# EAGLE design OSO-SCAN-A1-00 Sensor Candle Concept (EAGLE 9.6.2)
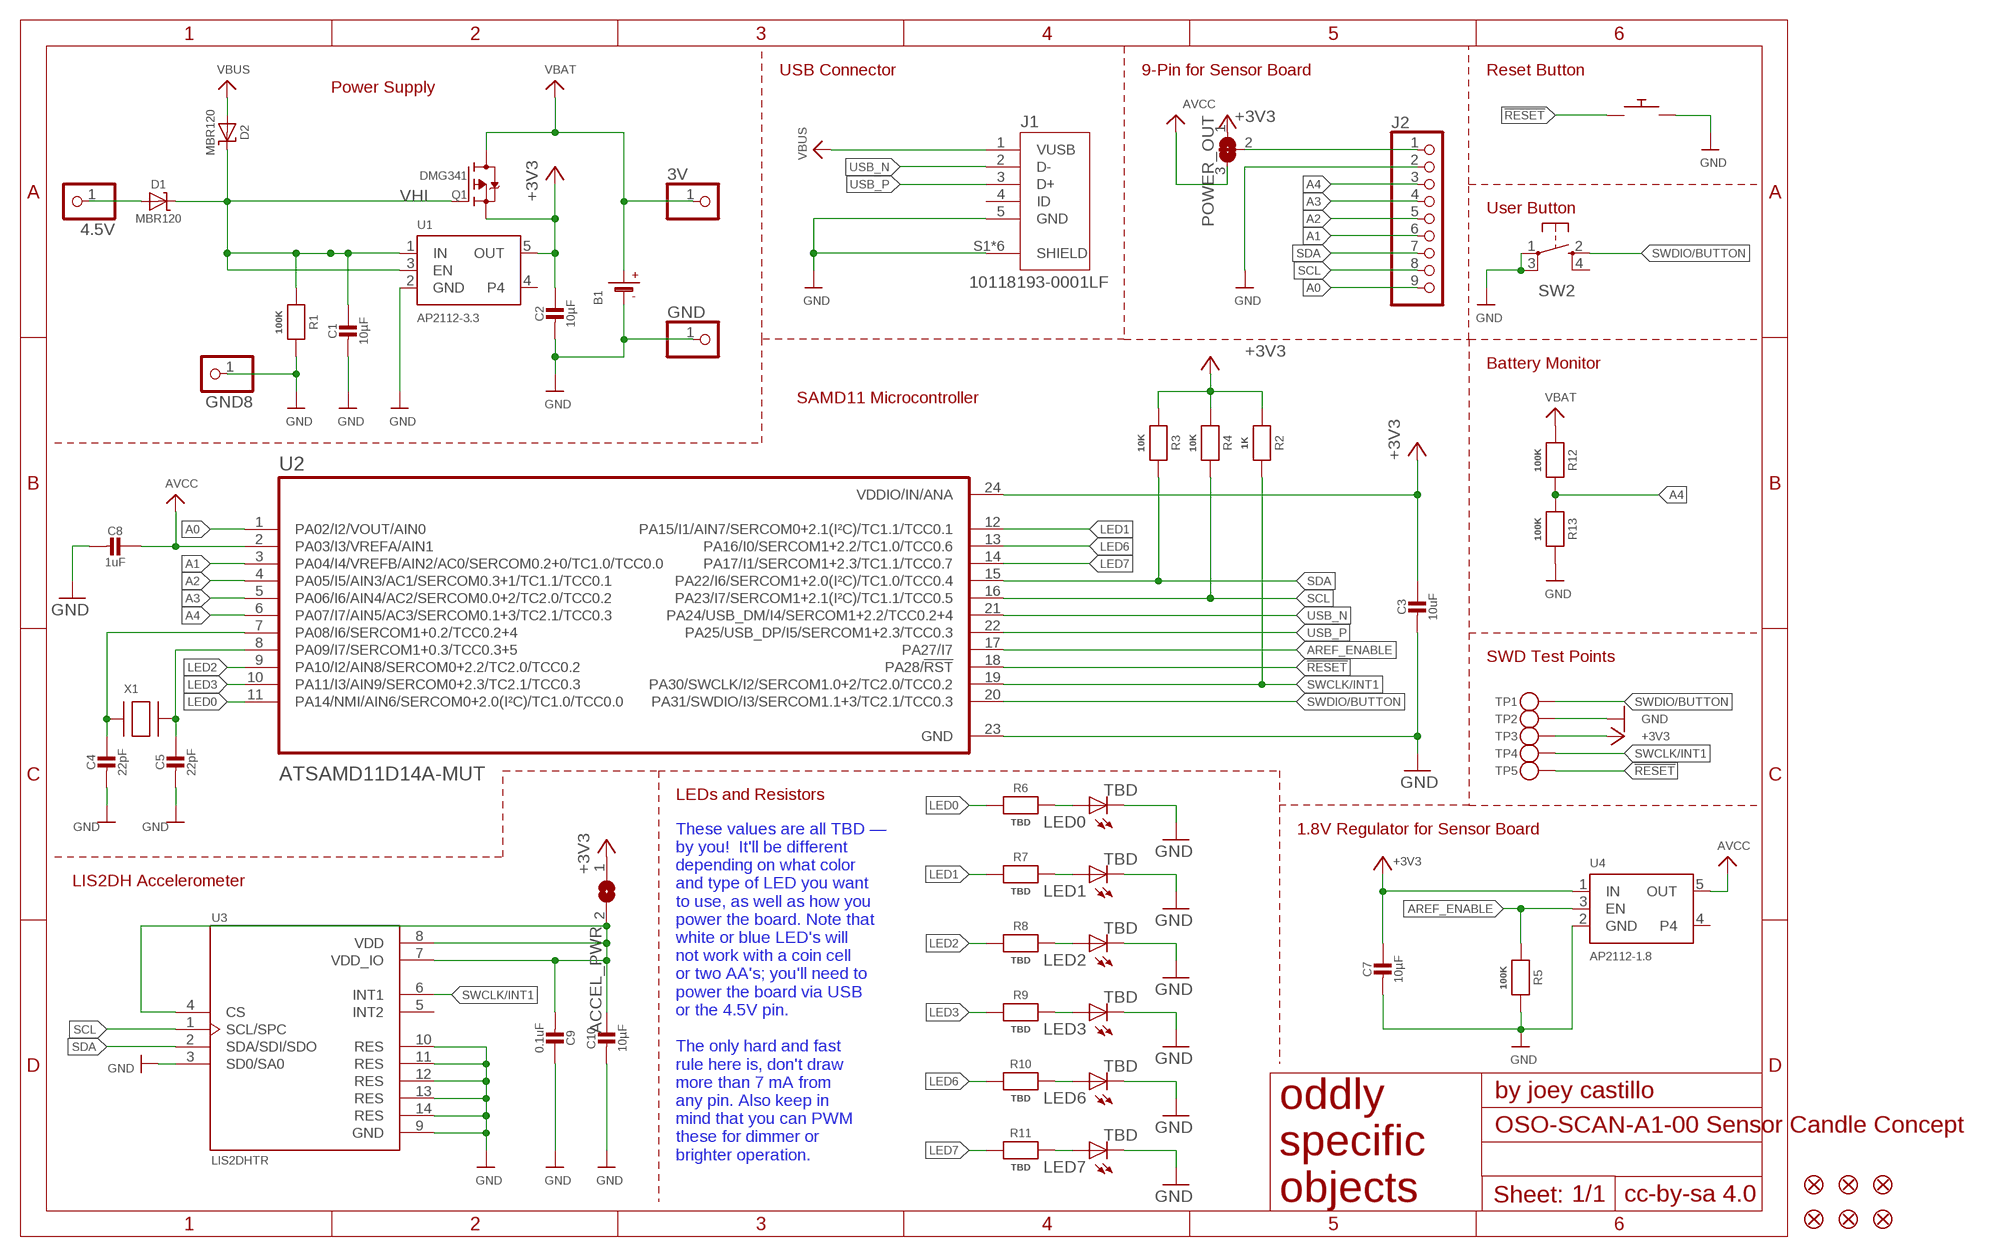
[diagram p0: schematic, sheet 1]

## Parts
3V  PINHD-1X1  [1X01]
4.5V  PINHD-1X1  [1X01]
ACCEL_PWR  SOLDERJUMPERREFLOW_NOPASTE  [SOLDERJUMPER_REFLOW_NOPASTE]
B1  BATTERY  [CR2032_SMT_BAT-HLD-BC-2003]
C1  10µF  CAP_CERAMIC0805-NOOUTLINE  [0805-NO]
C2  10µF  CAP_CERAMIC0805-NOOUTLINE  [0805-NO]
C3  10uF  CAP_CERAMIC0805-NOOUTLINE  [0805-NO]
C4  22pF  CAP_CERAMIC0805-NOOUTLINE  [0805-NO]
C5  22pF  CAP_CERAMIC0805-NOOUTLINE  [0805-NO]
C7  10µF  CAP_CERAMIC0805-NOOUTLINE  [0805-NO]
C8  1uF  CAP_CERAMIC0805-NOOUTLINE  [0805-NO]
C9  0.1uF  CAP_CERAMIC0805-NOOUTLINE  [0805-NO]
C10  10µF  CAP_CERAMIC0805-NOOUTLINE  [0805-NO]
D1  MBR120  DIODE-SCHOTTKYSOD-123  [SOD-123]
D2  MBR120  DIODE-SCHOTTKYSOD-123  [SOD-123]
FID1  FIDUCIAL_1MM  [FIDUCIAL_1MM]
FID2  FIDUCIAL_1MM  [FIDUCIAL_1MM]
FID3  FIDUCIAL_1MM  [FIDUCIAL_1MM]
FID4  FIDUCIAL_1MM  [FIDUCIAL_1MM]
FID5  FIDUCIAL_1MM  [FIDUCIAL_1MM]
FID6  FIDUCIAL_1MM  [FIDUCIAL_1MM]
GND  PINHD-1X1  [1X01]
GND8  PINHD-1X1  [1X01]
J1  10118193-0001LF  [FCI_10118193-0001LF]
J2  HEADER-1X9_JSTSH  [JST_SH9]
LED0  TBD  LEDCHIP-LED0805  [CHIP-LED0805]
LED1  TBD  LEDCHIP-LED0805  [CHIP-LED0805]
LED2  TBD  LEDCHIP-LED0805  [CHIP-LED0805]
LED3  TBD  LEDCHIP-LED0805  [CHIP-LED0805]
LED6  TBD  LEDCHIP-LED0805  [CHIP-LED0805]
LED7  TBD  LEDCHIP-LED0805  [CHIP-LED0805]
POWER_OUT  SOLDERJUMPER_2WAY  [SOLDERJUMPER_2WAY_OPEN_NOPASTE]
Q1  DMG341  MOSFET-P  [SOT23-R]
R1  100K  RESISTOR0805_NOOUTLINE  [0805-NO]
R2  1K  RESISTOR0805_NOOUTLINE  [0805-NO]
R3  10K  RESISTOR0805_NOOUTLINE  [0805-NO]
R4  10K  RESISTOR0805_NOOUTLINE  [0805-NO]
R5  100K  RESISTOR0805_NOOUTLINE  [0805-NO]
R6  TBD  RESISTOR0805_NOOUTLINE  [0805-NO]
R7  TBD  RESISTOR0805_NOOUTLINE  [0805-NO]
R8  TBD  RESISTOR0805_NOOUTLINE  [0805-NO]
R9  TBD  RESISTOR0805_NOOUTLINE  [0805-NO]
R10  TBD  RESISTOR0805_NOOUTLINE  [0805-NO]
R11  TBD  RESISTOR0805_NOOUTLINE  [0805-NO]
R12  100K  RESISTOR0805_NOOUTLINE  [0805-NO]
R13  100K  RESISTOR0805_NOOUTLINE  [0805-NO]
RESET  SWITCH_PUSHBUTTONC&K_KSS  [BTN_CK_KSS]
SW2  SPST_TACT-KMR2  [KMR2]
TP1  TESTPOINTROUND2MMNO  [TESTPOINT_ROUND_2MM_NO]
TP2  TESTPOINTROUND2MMNO  [TESTPOINT_ROUND_2MM_NO]
TP3  TESTPOINTROUND2MMNO  [TESTPOINT_ROUND_2MM_NO]
TP4  TESTPOINTROUND2MMNO  [TESTPOINT_ROUND_2MM_NO]
TP5  TESTPOINTROUND2MMNO  [TESTPOINT_ROUND_2MM_NO]
U1  AP2112-3.3  VREG_SOT23-5  [SOT23-5]
U2  ATSAMD11D14A-MUT  [QFN50P400X400X90-25N]
U3  LIS2DHTR  [PQFN35P200X200X100-14N]
U4  AP2112-1.8  VREG_SOT23-5  [SOT23-5]
X1  XTAL-3.2X1.5  [XTAL3215]

## Nets
4.5V: 4.5V.1 D1.A
!RESET: RESET.P$1 TP5.P$1 U2.18(PA28/!RST)
+3V3 [power]: ACCEL_PWR.1 C2.1 C3.1 C7.1 POWER_OUT.1 Q1.2(S) R2.1 R3.1 R4.1 TP3.P$1 U1.5(OUT) U2.24(VDDIO/IN/ANA) U4.1(IN)
A0: J2.9 U2.1(PA02/I2/VOUT/AIN0)
A1: J2.6 U2.3(PA04/I4/VREFB/AIN2/AC0/SERCOM0.2+0/TC1.0/TCC0.0)
A2: J2.5 U2.4(PA05/I5/AIN3/AC1/SERCOM0.3+1/TC1.1/TCC0.1)
A3: J2.4 U2.5(PA06/I6/AIN4/AC2/SERCOM0.0+2/TC2.0/TCC0.2)
A4: J2.3 R12.2 R13.1 U2.6(PA07/I7/AIN5/AC3/SERCOM0.1+3/TC2.1/TCC0.3)
ACCEL_POWER: ACCEL_PWR.2 C9.2 C10.1 U3.4(CS) U3.7(VDD_IO) U3.8(VDD)
AREF_ENABLE: R5.1 U2.17(PA27/I7) U4.3(EN)
AVCC [power]: C8.1 POWER_OUT.3 U2.2(PA03/I3/VREFA/AIN1) U4.5(OUT)
GND [gnd]: B1.- C1.2 C2.2 C3.2 C4.2 C5.2 C7.2 C8.2 C9.1 C10.2 GND8.1 GND.1 J1.5(GND) J1.S1(SHIELD) J1.S2(SHIELD) J1.S3(SHIELD) J1.S4(SHIELD) J1.S5(SHIELD) J1.S6(SHIELD) J2.2 LED0.C LED1.C LED2.C LED3.C LED6.C LED7.C R1.2 R5.2 R13.2 RESET.P$2 SW2.1(P) SW2.3(P1) TP2.P$1 U1.2(GND) U2.23(GND) U3.3(SD0/SA0) U3.9(GND) U3.10(RES) U3.11(RES) U3.12(RES) U3.13(RES) U3.14(RES) U4.2(GND)
LED0: R6.1 U2.11(PA14/NMI/AIN6/SERCOM0+2.0(I²C)/TC1.0/TCC0.0)
LED1: R7.1 U2.12(PA15/I1/AIN7/SERCOM0+2.1(I²C)/TC1.1/TCC0.1)
LED2: R8.1 U2.9(PA10/I2/AIN8/SERCOM0+2.2/TC2.0/TCC0.2)
LED3: R9.1 U2.10(PA11/I3/AIN9/SERCOM0+2.3/TC2.1/TCC0.3)
LED6: R10.1 U2.13(PA16/I0/SERCOM1+2.2/TC1.0/TCC0.6)
LED7: R11.1 U2.14(PA17/I1/SERCOM1+2.3/TC1.1/TCC0.7)
N$2: LED1.A R7.2
N$4: LED2.A R8.2
N$5: LED0.A R6.2
N$6: LED3.A R9.2
N$7: LED6.A R10.2
N$8: LED7.A R11.2
POWER_OUT [power]: J2.1 POWER_OUT.2
SCL: J2.8 R4.2 U2.16(PA23/I7/SERCOM1+2.1(I²C)/TC1.1/TCC0.5) U3.1(SCL/SPC)
SDA: J2.7 R3.2 U2.15(PA22/I6/SERCOM1+2.0(I²C)/TC1.0/TCC0.4) U3.2(SDA/SDI/SDO)
SWCLK/INT1: R2.2 TP4.P$1 U2.19(PA30/SWCLK/I2/SERCOM1.0+2/TC2.0/TCC0.2) U3.6(INT1)
SWDIO/BUTTON: SW2.2(S) TP1.P$1 U2.20(PA31/SWDIO/I3/SERCOM1.1+3/TC2.1/TCC0.3)
USB_N: J1.2(D-) U2.21(PA24/USB_DM/I4/SERCOM1+2.2/TCC0.2+4)
USB_P: J1.3(D+) U2.22(PA25/USB_DP/I5/SERCOM1+2.3/TCC0.3)
VBAT [power]: 3V.1 B1.+$1(+) B1.+$2(+) Q1.3(D) R12.1
VBUS [power]: D2.A J1.1(VUSB)
VHI [power]: C1.1 D1.C D2.C Q1.1(G) R1.1 U1.1(IN) U1.3(EN)
XIN32: C4.1 U2.7(PA08/I6/SERCOM1+0.2/TCC0.2+4) X1.P$1
XOUT32: C5.1 U2.8(PA09/I7/SERCOM1+0.3/TCC0.3+5) X1.P$2
Unconnected: J1.4(ID) SW2.4(S1) U1.4 U3.5(INT2) U4.4

## Notes on the sheet
- USB Connector | 9-Pin for Sensor Board | Reset Button
- Power Supply
- User Button
- Battery Monitor
- SAMD11 Microcontroller
- SWD Test Points
- LEDs and Resistors
- These values are all TBD — 
  by you!  It'll be different 
  depending on what color 
  and type of LED you want 
  to use, as well as how you 
  power the board. Note that
  white or blue LED's will
  not work with a coin cell
  or two AA's; you'll need to
  power the board via USB 
  or the 4.5V pin.
  
  The only hard and fast 
  rule here is, don't draw 
  more than 7 mA from 
  any pin. Also keep in 
  mind that you can PWM 
  these for dimmer or 
  brighter operation.
- 1.8V Regulator for Sensor Board
- LIS2DH Accelerometer

## Library data of the parts
3V 4.5V GND GND8 = pinhead-round:PINHD-1X1: PIN HEADER
ACCEL_PWR = microbuilder:SOLDERJUMPER: SMD Solder JUMPER Solder the two pads together to create a connection, or remove the solder to break it. REFLOW - Use this footprint for solder paste and reflow ovens. WAVE - Use this footprint for hand-soldering (larger pads). CLOSED - Has a trace between the two pads to ensure it is closed by default. The trace needs to be cut to disable the jumper, and can be closed again by creating a solder bridge between the two pads.
B1 = OSO-VOCA-A1-00:BATTERY: CR1220 SMT - Digikey: 3001K-ND CD2032 BAT-HLD-001 - Digikey: BAT-HLD-001-ND
C1-C5 C7-C10 = microbuilder:CAP_CERAMIC: Ceramic Capacitors For new designs, use the packages preceded by an '_' character since they are more reliable: The following footprints should be used on most boards: _0402 - Standard footprint for regular board layouts _0603 - Standard footprint for regular board layouts _0805 - Standard footprint for regular board layouts _1206 - Standard footprint for regular board layouts For extremely tight-pitch boards where space is at a premium, the following 'micro-pitch' footprints can be used (smaller pads, no silkscreen outline, etc.): _0402MP - Micro-pitch footprint for very dense/compact boards _0603MP - Micro-pitch footprint for very dense/compact boards _0805MP - Micro-pitch footprint for very dense/compact boards _1206MP - Micro-pitch footprint for very dense/compact boards
D1 D2 = microbuilder:DIODE-SCHOTTKY
FID1-FID6 = microbuilder:FIDUCIAL: Fiducial Alignment Points Various fiducial points for machine vision alignment.; BOM: EXCLUDE
J1 = 10118193-0001LF:10118193-0001LF: Micro USB B Type Receptacle; DESCRIPTION: Single Port 5 Contact Shielded SMT MICRO USB B-Type Receptacle; DIGI-KEY_PART_NUMBER: 609-4616-1-ND; DIGI-KEY_PURCHASE_URL: https://www.digikey.com/product-detail/en/amphenol-icc-fci/10118193-0001LF/609-4616-1-ND/2785380?utm_source=snapeda&utm_medium=aggregator&utm_campaign=symbol; MF: Amphenol ICC; MP: 10118193-0001LF; PACKAGE: None
J2 = microbuilder:HEADER-1X9: PIN HEADER
LED0 LED1-LED3 LED6 LED7 = adafruit:LED: LED OSRAM: - CHIPLED LG R971, LG N971, LY N971, LG Q971, LY Q971, LO R971, LY R971 LH N974, LH R974 LS Q976, LO Q976, LY Q976 LO Q996 - Hyper CHIPLED LW Q18S LB Q993, LB Q99A, LB R99A - SideLED LS A670, LO A670, LY A670, LG A670, LP A670 LB A673, LV A673, LT A673, LW A673 LH A674 LY A675 LS A676, LA A676, LO A676, LY A676, LW A676 LS A679, LY A679, LG A679 - Hyper Micro SIDELED® LS Y876, LA Y876, LO Y876, LY Y876 LT Y87S - SmartLED LW L88C, LW L88S LB L89C, LB L89S, LG L890 LS L89K, LO L89K, LY L89K LS L896, LA L896, LO L896, LY L896 - TOPLED LS T670, LO T670, LY T670, LG T670, LP T670 LSG T670, LSP T670, LSY T670, LOP T670, LYG T670 LG T671, LOG T671, LSG T671 LB T673, LV T673, LT T673, LW T673 LH T674 LS T676, LA T676, LO T676, LY T676, LB T676, LH T676, LSB T676, LW T676 LB T67C, LV T67C, LT T67C, LS T67K, LO T67K, LY T67K, LW E67C LS E67B, LA E67B, LO E67B, LY E67B, LB E67C, LV E67C, LT E67C LW T67C LS T679, LY T679, LG T679 LS T770, LO T770, LY T770, LG T770, LP T770 LB T773, LV T773, LT T773, LW T773 LH T774 LS E675, LA E675, LY E675, LS T675 LS T776, LA T776, LO T776, LY T776, LB T776 LHGB T686 LT T68C, LB T68C - Hyper Mini TOPLED® LB M676 - Mini TOPLED Santana® LG M470 LS M47K, LO M47K, LY M47K Source: http://www.osram.convergy.de/
POWER_OUT = pygamer-microbuilder:SOLDERJUMPER_2WAY: 2-Way Solder Jumper
Q1 = microbuilder:MOSFET-P: P-Channel Mosfet LEGEND VDS: Voltage Drain-Source ID: Drain Current RDS(ON): Drain-Source On-State Resistance VGS(TH): Gate-Source Threshold Voltage CISS: Drain-Source Input Capacitance SOT-23 Name VDS ID RDS(ON) VGS(TH) CISS Order Number IRLML5103 30V 760mA 600 mOhm -- 75pF @ 25V Digikey: IRLML5103PBFCT-ND IRLML6401 12V 4.3A 50 mOhm 950mV @ 250µA 830pF @ 10V Digikey: IRLML6401PBFTR-ND NTR0202PL 20V 400mA 800 mOhm 2.3V @ 250uA 70pF @ 5V Digikey: NTR0202PLT1GOSTR-ND NTR4101PT1G 20V 1.8A 85 mOhm 1.2V @ 250uA 675pF @ 10V Digikey: NTR4101PT1GOSCT-ND DMP2004K 20V 600mA 900 mOhm 1V @ 250uA 175pF @ 16V Digikey: DMP2004KDICT-ND PMV65XP 20V 3.9A 76 mOhm 950mV @ 1mA 725pF @ 20V Digikey: 568-2358-2-ND TO-252 Name VDS ID RDS(ON) VGS(TH) CISS Order Number AOD417 30V 25A 34 mOhm 3V @ 250µA 920pF @ 15V Digikey: 785-1106-2-ND PowerPak Name VDS ID RDS(ON) VGS(TH) CISS Order Number AON7401 30V 12A 14 mOhm 3V @ 250µA 2600pF @ 15V Digikey: 785-1302-1-ND
R1-R13 = microbuilder:RESISTOR: Resistors For new designs, use the packages preceded by an '_' character since they are more reliable: The following footprints should be used on most boards: _0402 - Standard footprint for regular board layouts _0603 - Standard footprint for regular board layouts _0805 - Standard footprint for regular board layouts _1206 - Standard footprint for regular board layouts For extremely tight-pitch boards where space is at a premium, the following 'micro-pitch' footprints can be used (smaller pads, no silkscreen outline, etc.): _0402MP - Micro-pitch footprint for very dense/compact boards _0603MP - Micro-pitch footprint for very dense/compact boards _0805MP - Micro-pitch footprint for very dense/compact boards _1206MP - Micro-pitch footprint for very dense/compact boards
RESET = adafruit:SWITCH_PUSHBUTTON: Buttons SOFTTOUCHSMD_SJ - Soft touch temporary push button (Super Junk Akihabara) Compatible with SKPMANE010 [Mouser: 688-SKPMAN] C&K_KSS = Digikey: KSS221GLFS
SW2 = adafruit:SPST_TACT: SMT 6mm switch, EVQQ2 series http://www.ladyada.net/library/eagle
TP1-TP5 = microbuilder:TESTPOINT: Test Point Various test points for characterisation and PCB testing TESTPOINT_SMT - Compact Surface Mount Test Point [Digikey: 5016KTR-ND]
U1 U4 = microbuilder:VREG_SOT23-5: SOT23-5 Fixed Voltage Regulators Part Current Out V Out V In V Dropout θJA (°C/W) TJ (°C) Digikey Part No. ADP121 150mA 3.3V 3.4-5.5V 0.09V @ 150mA -- -- ADP121-AUJZ33R7CT-ND ADP121 150mA 3.0V 3.1-5.5V 0.09V @ 150mA -- -- ADP121-AUJZ30R7CT-ND ADP122 300mA 3.3V 3.4-5.5V 0.085V @ 300mA -- -- ADP122AUJZ-3.3-R7CT-ND ADP1712 300mA 3.3V 3.5-5.5V 0.17V @ 300mA -- -- ADP1712AUJZ-3.3-R7TR-ND AP7311 (Low Cost) 150mA 3.3V 3.5-6V 0.15V @ 150mA -- -- AP7311-33WG-7DICT-ND LD39015M18R 150mA 1.8V 1.9V-5.5V 0.08V @ 100mA -- -- 497-6977-1-ND LP2985A-33DBVR 150mA 3.3V 3.3-16V 0.28V @ 150mA 206 150 296-18479-1-ND MCP1824T-3302E/OT 300mA 3.3V 3.5V-6V 0.2V @ 300mA -- -- MCP1824T-3302E/OTCT-ND MIC5205-2.5YM5 TR 150mA 2.5V 2.7-16V 0.165V @ 150mA -- -- 576-1257-2-ND MIC5205-3.0YM5 TR 150mA 3.0V 3.2V-16V 0.165V @ 150mA -- -- 576-1258-2-ND MIC5205-3.3YM5 TR 150mA 3.3V 3.5V-16V 0.165V @ 150mA -- -- 576-1259-2-ND TPS780330220 150mA 3.3V+2.2V 3.6-5.5V 250mV Max -- -- 296-23332-1-ND TDA3663/N1,135 100mA 3.3V 3.5-45V 0.18V @ 50mA -- -- 568-5343-1-ND Max operating temp can be calculated using θJA, TJ (max junction temperature), and power in watts. Set the "Maximum Ambient Temperature" until it reaches TJ ("Max Junction Temperature"), which is the absolute limit for safe use of the regulator: Heat Sink Temperature Calculator <http://www.daycounter.com/Calculators/Heat-Sink-Temperature-Calculator.phtml> For example, With 12V source into a 3.3V LP2985 and a 30mA load, we are dissipating (12V-3.3V) * 0.03A = 0.261W. With a θJA of 206 °C/W, a TJ of 150°C, and 261mW we can safely use the chip without a heat sink up to 75°C (=147.1°C Junction Temperature).
U2 = My Stuff:ATSAMD11D14A-MUT: None; AVAILABILITY: Unavailable; DESCRIPTION: Cortex-M0+, 16KB FLASH, 4KB SRAM, USB - 24 QFN, INDUSTRIAL, GREEN, 1.6-3.6V, 48MHz/ QFN _ZA_; MF: Microchip; MP: ATSAMD11D14A-MUT; PACKAGE: QFN-24 Microchip; PRICE: None
U3 = LIS2DHTR:LIS2DHTR: MEMS digital output motion sensor: ultra low-power high performance 3-axes femto accelerometer; DESCRIPTION: Accelerometer X, Y, Z Axis ±2g, 4g, 8g, 16g 0.5Hz ~ 672Hz 14-LGA _2x2_; DIGI-KEY_PART_NUMBER: 497-13795-1-ND; DIGI-KEY_PURCHASE_URL: https://www.digikey.com/product-detail/en/stmicroelectronics/LIS2DHTR/497-13795-1-ND/4209308?utm_source=snapeda&utm_medium=aggregator&utm_campaign=symbol; MF: STMicroelectronics; MP: LIS2DHTR; PACKAGE: LGA-14 STMicroelectronics
X1 = adafruit:XTAL: Low cost SMT crystals, no capacitors included http://www.ladyada.net/library/eagle

## Net classes
0 default: width 0.152 mm, drill 0.254 mm
1 power: width 0.254 mm, drill 0.254 mm

## Board
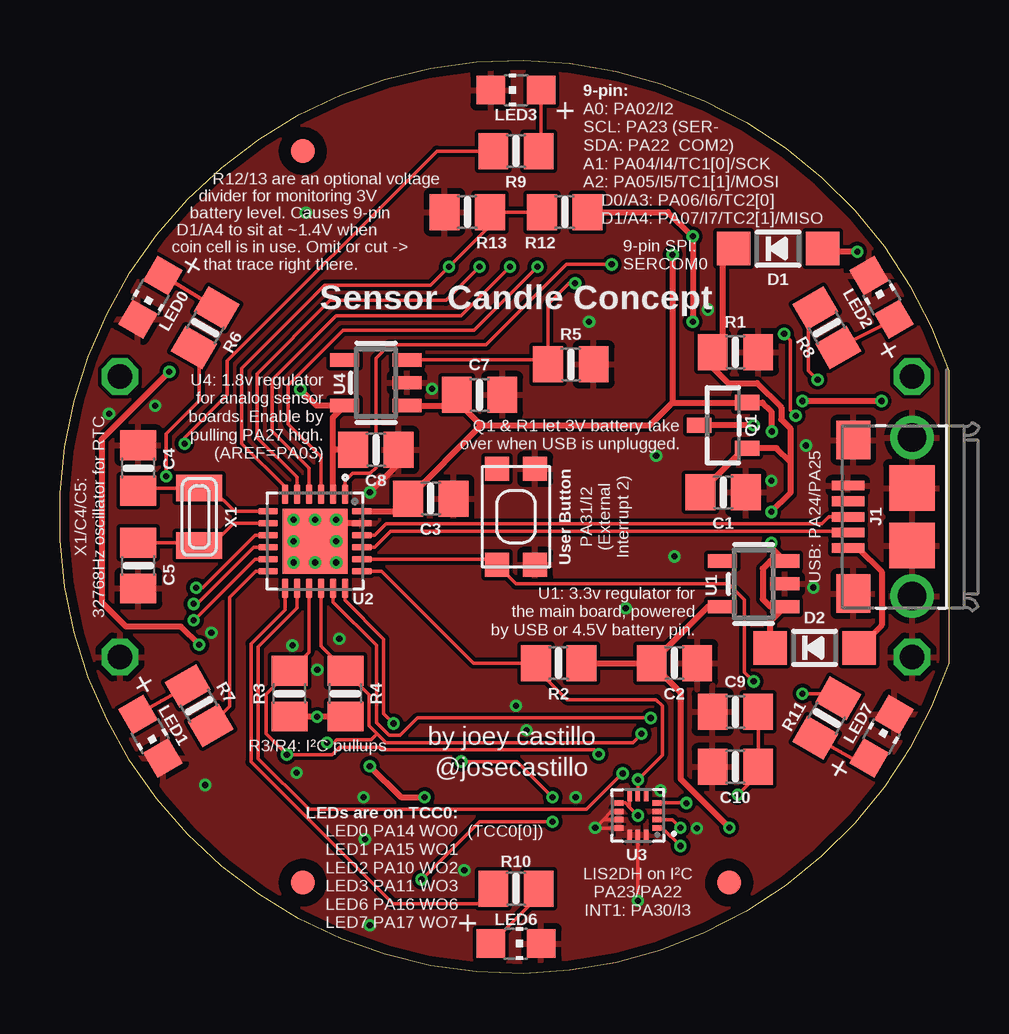
[diagram p1: board, top side]
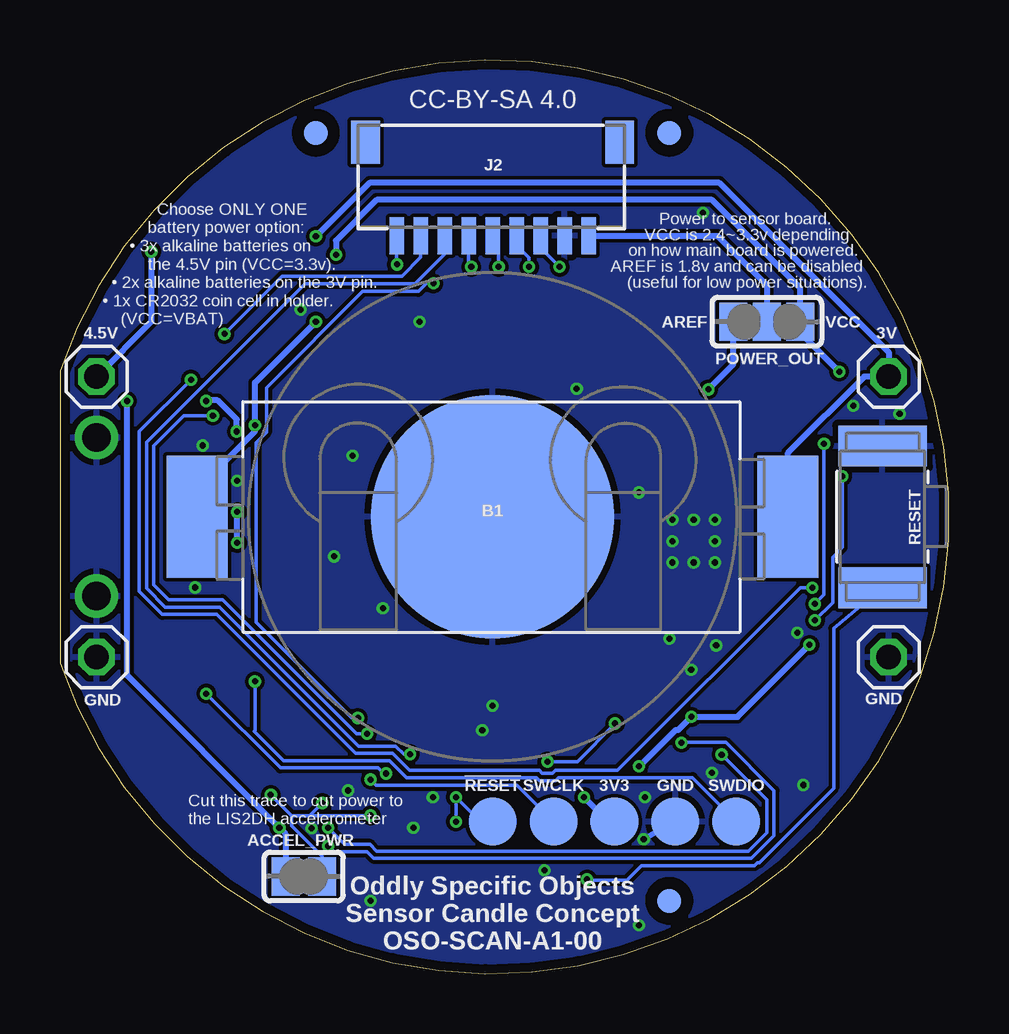
[diagram p2: board, bottom side, seen from below]

Size 37.05 x 38.07 mm. Coordinates in mm from the lower left corner, seen from the top.
Outline: 37.05,25.13 37.05,12.94 arc-323 37.05,25.13
Copper layers (1*16): Top 0.035559375mm / dielectric 1.6mm / Bottom 0.035559375mm
Design rules "oshpark-2layer *": minimum track width 6mil, minimum drill 10mil, track to track 6mil, track to pad 6mil, pad to pad 6mil, via to via 6mil, smd to smd 6mil, copper to edge 15mil, drill to drill 6mil, minimum pad ring 5mil, minimum via ring 5mil, stop-mask expansion 2.5mil, vias tented up to drill 12mil, thermal gap 10mil

### Footprints (pad centres in the part's own frame; a part is rotated, then mirrored left to right if it is on the bottom)
1X01 = drill 1.016 octagon: 1 0,0
SOLDERJUMPER_REFLOW_NOPASTE = smd 1.168 x 1.6: 1 -0.762,0; 2 0.762,0
CR2032_SMT_BAT-HLD-BC-2003 = smd 2.54 x 5.08: +$1 -12.319,0; +$2 12.319,0 | smd 10.16 x 10.16: - 0,0
0805-NO = smd 1.24 x 1.5: 1 -0.95,0; 2 0.95,0
SOD-123 = smd 1.4 x 1.4: A 1.85,0; C -1.85,0
FIDUCIAL_1MM = smd 1 x 1: 1 0,0
FCI_10118193-0001LF = smd 0.4 x 1.35: 1 -1.3,2.675; 2 -0.65,2.675; 3 0,2.675; 4 0.65,2.675; 5 1.3,2.675 | smd 1.6 x 1.4: S1 -3.2,2.45; S2 3.2,2.45 | smd 1.9 x 1.9: S3 1.2,0; S4 -1.2,0 | drill 1.2: S5 3.302,0; S6 -3.302,0
JST_SH9 = smd 0.6 x 1.55: 1 -4,2.514; 2 -3,2.514; 3 -2,2.514; 4 -1,2.514; 5 0,2.514; 6 1,2.514; 7 2,2.514; 8 3,2.514; 9 4,2.514 | smd 1.2 x 1.8: MT1 -5.3,-1.386; MT2 5.3,-1.386
CHIP-LED0805 = smd 1.2 x 1.2: A 0,-1.05; C 0,1.05
SOLDERJUMPER_2WAY_OPEN_NOPASTE = smd 1.168 x 1.6: 1 -1.397,0; 2 0,0; 3 1.397,0
SOT23-R = smd 0.635 x 1.016: 1 -0.95,-1; 2 0.95,-1; 3 0,1
BTN_CK_KSS = smd 1.7 x 3.7: P$1 -2.95,0; P$2 2.95,0
KMR2 = smd 1 x 1: 1 2,0.8; 2 2,-0.8; 3 -2,0.8; 4 -2,-0.8
TESTPOINT_ROUND_2MM_NO = smd 2 x 2: P$1 0,0
SOT23-5 = smd 0.55 x 1.2: 1 -0.95,-1.3; 2 0,-1.3; 3 0.95,-1.3; 4 0.95,1.3; 5 -0.95,1.3
QFN50P400X400X90-25N = smd 0.81 x 0.27: 1 -1.955,1.25; 2 -1.955,0.75; 3 -1.955,0.25; 4 -1.955,-0.25; 5 -1.955,-0.75; 6 -1.955,-1.25; 13 1.955,-1.25; 14 1.955,-0.75; 15 1.955,-0.25; 16 1.955,0.25; 17 1.955,0.75; 18 1.955,1.25 | smd 0.27 x 0.81: 7 -1.25,-1.955; 8 -0.75,-1.955; 9 -0.25,-1.955; 10 0.25,-1.955; 11 0.75,-1.955; 12 1.25,-1.955; 19 1.25,1.955; 20 0.75,1.955; 21 0.25,1.955; 22 -0.25,1.955; 23 -0.75,1.955; 24 -1.25,1.955 | smd 2.7 x 2.7: 25 0,0
PQFN35P200X200X100-14N = smd 0.39 x 0.2: 1 -0.795,0.525; 2 -0.795,0.175; 3 -0.795,-0.175; 4 -0.795,-0.525; 8 0.795,-0.525; 9 0.795,-0.175; 10 0.795,0.175; 11 0.795,0.525 | smd 0.2 x 0.39: 5 -0.35,-0.795; 6 0,-0.795; 7 0.35,-0.795; 12 0.35,0.795; 13 0,0.795; 14 -0.35,0.795
XTAL3215 = smd 1.1 x 1.9: P$1 1.2,0; P$2 -1.2,0

### Placement (x,y rotation side)
3V  2.5,24.88 0 bottom
4.5V  35.52,24.88 0 bottom
ACCEL_PWR  26.89,4.05 0 bottom
B1  19.01,19.03 0 bottom
C1  27.65,20.05 0 top
C2  25.62,12.94 0 top
C3  15.46,19.8 0 top
C4  3.26,21.07 90 top
C5  3.26,17 270 top
C7  17.49,24.11 0 top
C8  13.17,21.83 0 top
C9  28.16,10.91 0 top
C10  28.16,8.62 180 top
D1  29.93,30.21 0 top
D2  31.46,13.57 0 top
FID1  10.12,34.27 0 top
FID2  27.9,3.79 0 top
FID3  10.12,3.79 0 top
FID4  11.65,35.04 0 bottom
FID5  26.38,35.04 0 bottom
FID6  11.65,3.03 0 bottom
GND  2.5,13.19 0 bottom
GND8  35.52,13.19 0 bottom
J1  35.52,19.03 90 top
J2  19.01,33.26 180 bottom
LED0  3.77,28.18 150 top
LED1  3.77,9.89 210 top
LED2  34.25,28.18 30 top
LED3  19.01,36.81 90 top
LED6  19.01,1.25 270 top
LED7  34.25,9.89 330 top
POWER_OUT  7.58,27.16 180 bottom
Q1  27.65,22.84 90 top
R1  28.16,25.89 0 top
R2  20.79,12.94 180 top
R3  9.56,11.67 90 top
R4  11.9,11.67 90 top
R5  21.3,25.38 0 top
R6  6.06,26.91 60 top
R7  5.8,11.16 120 top
R8  31.97,26.91 300 top
R9  19.01,34.27 0 top
R10  19.01,3.54 0 top
R11  31.97,10.65 240 top
R12  21.04,31.73 180 top
R13  16.98,31.73 180 top
RESET  2.76,19.03 90 bottom
SW2  19.01,19.03 270 top
TP1  8.85,6.33 180 bottom
TP2  11.39,6.33 180 bottom
TP3  13.93,6.33 180 bottom
TP4  16.47,6.33 180 bottom
TP5  19.01,6.33 180 bottom
U1  28.92,16.24 90 top
U2  10.63,18.02 270 top
U3  24.09,6.59 180 top
U4  13.17,24.62 90 top
X1  5.8,19.03 90 top

### Tracks (layer width: path | path; a pad name or v marks a point on that pad's centre or on a via)
4.5V  (via drill 0.25)
  Top 0.254: v33.24,30.08 31.91,30.08 D1.A
  Bottom 0.254: v33.24,30.08 33.24,27.16 4.5V.1
!RESET  (via drill 0.25)
  Top 0.152: U2.18 11.88,15.55 13.5,13.93 13.5,10.83 v13.91,10.42 | v16.73,8.84 19.05,8.84 v20.54,7.35 | v15.07,3.92 17.49,6.33 v20.54,6.33
  Bottom 0.152: TP5.P$1 19.52,6.33 v20.54,7.35 v20.54,6.33 | v16.73,8.84 15.48,8.84 13.91,10.41 v13.91,10.42 | RESET.P$1 4.79,14.38 4.79,7.73 7.9,4.62 7.97,4.62 8.09,4.5 12.8,4.5 13.4,3.9 15.05,3.9 v15.07,3.92
+3V3  (via drill 0.25)
  Top 0.254: 25.54,23.79 Q1.2 29.29,23.79 29.65,23.43 29.65,22.61 v29.68,22.59 | v25.54,29.96 25.54,23.79 | R3.1 10.7,10.72 v10.72,10.7 10.73,10.72 R4.1 | v12.92,8.64 14.21,7.35 v15.2,7.35 | v4.56,25.08 1.74,22.26 1.74,15.48 2.76,14.46 5.04,14.46 v5.8,13.7 | v27.9,6.08 25.87,8.11 25.87,11.73 C2.1 | v30.95,23.86 v34.25,23.86 | U2.24 13.98,19.27 C3.1 17.55,22.84 | U4.1 16.1,23.67 C7.1 16.54,23.86 17.55,22.84 | 25.54,23.79 24.59,22.84 17.55,22.84 | R2.1 C2.1 | C2.1 27.02,15.29 U1.5
  Bottom 0.254: v15.2,7.35 14.19,6.33 TP3.P$1 | v25.54,29.96 25.54,30.54 23.84,32.24 9.87,32.24 6.18,28.56 POWER_OUT.1 6.18,26.7 v4.56,25.08 | v12.92,8.64 12.88,8.64 11.37,10.16 11.26,10.16 v10.72,10.7 8.8,10.7 v5.8,13.7 | ACCEL_PWR.1 27.65,5.83 v27.9,6.08 34.25,12.43 v34.25,23.86 | v29.68,22.59 29.68,23.09 30.47,23.88 30.92,23.88 v30.95,23.86
A0  (via drill 0.25)
  Top 0.152: U2.1 11.88,20.54 12.19,20.85 12.93,20.85 13.17,21.08 13.17,25.64 13.73,26.2 17.76,26.2 21.12,29.55 v23,29.55
  Bottom 0.152: J2.9 v23.01,29.56 v23,29.55
A1  (via drill 0.25)
  Top 0.152: U2.3 10.88,21.53 9.51,22.9 9.51,24.52 11.8,26.81 17.26,26.81 v19.9,29.45
  Bottom 0.152: J2.6 20.01,29.56 v19.9,29.45
A2  (via drill 0.25)
  Top 0.152: v18.76,29.45 16.73,27.42 11.52,27.42 8.85,24.75 8.85,22.59 10.38,21.06 U2.4
  Bottom 0.152: v18.76,29.45 18.76,30.09 19.01,30.35 J2.5
A3  (via drill 0.25)
  Top 0.152: v17.49,29.45 16.09,28.05 11.26,28.05 8.22,25 8.22,22.34 9.88,20.67 U2.5
  Bottom 0.152: v17.49,29.45 17.49,29.82 18.01,30.35 J2.4
A4  (via drill 0.25)
  Top 0.152: U2.6 9.38,20.28 7.58,22.08 7.58,25.23 11.04,28.69 15.46,28.69 v16.22,29.45 17.93,31.16 R13.1 R12.2
  Bottom 0.152: J2.3 17.01,30.24 v16.22,29.45
ACCEL_POWER  (via drill 0.25)
  Top 0.152: U3.8 23.57,7.11 23.74,6.94 | 23.74,6.94 v24.09,6.59 | v28.26,7.45 29.11,8.3 C10.1 C9.2 | U3.7 23.74,6.94 | U3.4 v26.1,7.11 v26.11,7.11
  Bottom 0.152: v24.09,6.59 26.63,6.59 | 26.63,6.59 27.39,6.59 | v28.26,7.45 27.39,6.59 | ACCEL_PWR.2 26.12,4.89 27.39,6.16 27.39,6.59 | v26.11,7.11 26.63,6.59
  Bottom 0.254: ACCEL_PWR.2 27.65,4.05
AREF_ENABLE  (via drill 0.25)
  Top 0.152: U4.3 20.16,25.57 R5.1 20.35,27.89 21.22,28.76 v21.48,28.76 | U2.17 11.39,16.05 11.39,15.48 13.19,13.67 13.19,10.45 13.72,9.93 14.19,9.93 14.91,10.65 v24.62,10.65
  Bottom 0.152: v24.62,10.65 24.88,10.65 28.87,14.64 28.87,22.13 28.43,22.56 28.43,24.42 24.42,28.43 22.1,28.43 21.77,28.76 v21.48,28.76
AVCC  (via drill 0.25)
  Top 0.254: U2.2 11.38,21.83 | 11.38,21.83 11.38,23.18 U4.5 10.69,23.67 v10.02,24.34 | C8.1 11.38,21.83
  Bottom 0.254: v10.02,24.34 8.98,25.38 POWER_OUT.3
GND  (via drill 0.25)
  Top 0.152: U3.13 v24.09,3.03 | U3.11 22.33,6.06 v22.31,6.08 22.65,6.41 | 22.65,6.41 U3.10 | U3.9 23,6.76 22.65,6.41
  Top 0.254: U2.23 11.66,18.77 v11.52,18.91 | v12.92,20.05 14.12,21.25 C8.2
  Bottom 0.254: TP2.P$1 11.44,6.33 v12.71,5.6
  other vias: 12.66,7.35 9.87,8.37 6.06,7.86 16.85,4.3 12.92,2.02 24.85,21.57 22.06,27.16 10.25,31.71 23.58,15.22 19.01,11.16 25.03,7.63 26.56,6.05 31.1,22.01 31.41,16.09 25.62,17.38 6.31,14.21 19.44,10.14 11.65,13.95 10.73,12.66 9.69,13.67 21.5,7.35 2.04,23.33 3.97,23.66 29.65,20.53 27.01,27.67 9.74,18.91 10.63,18.91 10.63,17.13 11.52,17.13 11.52,18.02 9.74,18.02 9.74,17.13 15.51,24.37
  pour Bottom: -0.04,38.08 37.05,38.08 37.05,-0.02 -0.04,-0.02
  pour Top: 37.05,38.08 -0.04,38.08 -0.04,-0.02 37.05,-0.02
LED0  (via drill 0.25)
  Top 0.152: v5.57,14.72 5.62,14.77 5.63,14.77 8.13,17.27 U2.11 | R6.1 5.8,25.86 5.8,23.86 4.43,22.49 v4.43,20.72
  Bottom 0.152: v4.43,20.72 4.43,17.76 4.83,17.36 4.83,15.46 v5.57,14.72
LED1
  Top 0.152: U2.12 8.17,16.77 7.07,15.67 7.07,11.13 R7.1
LED2  (via drill 0.25)
  Top 0.152: U2.9 8.14,18.27 5.95,16.08 v5.68,16.08 | v31.58,24.75 31.2,25.13 31.2,27.44 R8.1
  Bottom 0.152: v5.68,16.08 6.19,16.08 13.8,8.47 16.39,8.47 16.51,8.35 16.94,8.35 17.06,8.47 22.47,8.47 23.18,9.18 24.73,9.18 30.52,14.97 32.78,14.97 33.74,15.93 33.74,22.59 v31.58,24.75
LED3  (via drill 0.25)
  Top 0.152: U2.10 8.06,17.76 5.78,15.48 5.65,15.48 v5.57,15.4 | v5.19,22.08 5.19,22.34 6.97,24.11 6.97,25.54 15.71,34.27 R9.1
  Bottom 0.152: v5.57,15.4 5.19,15.78 v5.19,22.08
LED6
  Top 0.152: U2.13 9.38,15.17 7.96,13.75 7.96,8.82 13.88,2.9 17.43,2.9 R10.1
LED7  (via drill 0.25)
  Top 0.152: U2.14 9.88,15.24 8.27,13.62 8.27,8.95 10.38,6.84 21.96,6.84 v23.46,8.34 | v30.95,11.67 32.25,11.67 R11.1
  Bottom 0.152: v23.46,8.34 23.56,8.34 23.79,8.57 27.85,8.57 v30.95,11.67
N$2
  Top 0.152: LED1.A R7.2
N$4
  Top 0.152: LED2.A R8.2
N$5
  Top 0.152: LED0.A R6.2
N$6
  Top 0.152: LED3.A 20.06,34.37 R9.2
N$7
  Top 0.152: LED6.A 19.96,3.25 R10.2
N$8
  Top 0.152: R11.2 33.02,8.98 LED7.A
POWER_OUT
  Bottom 0.254: J2.1 9.64,30.74 7.58,28.69 POWER_OUT.2 9.11,27.16
SCL  (via drill 0.25)
  Top 0.152: U2.16 10.88,13.64 R4.2 12.89,11.63 12.89,10.32 13.22,9.99 | U3.1 25.12,6.06 v25.87,5.32 | v24.25,9.99 23.88,9.62 13.59,9.62 13.22,9.99 | v30.19,26.65 30.44,26.4 30.44,23.48 v30.67,23.25 | v11.14,9.62 11.42,9.62 11.53,9.74 12.97,9.74 13.22,9.99
  Bottom 0.152: v25.87,5.32 25.63,5.08 24.24,5.08 23.96,4.8 8.22,4.8 7.28,5.74 7.28,7.63 9.29,9.64 11.14,9.64 v11.14,9.62 | v24.25,9.99 24.68,9.99 30.27,15.58 32.52,15.58 33.13,16.2 33.13,22 31.88,23.25 v30.67,23.25 | v30.19,26.65 27.78,29.06 22.79,29.06 22.01,29.84 J2.8
SDA  (via drill 0.25)
  Top 0.152: U2.15 10.38,13.38 9.61,12.62 R3.2 8.58,11.64 8.58,10 v9.46,9.13 | U3.2 25.54,6.41 v25.87,6.08 | v22.46,9.14 22.28,9.32 13.46,9.32 13.35,9.43 11.66,9.43 11.35,9.13 v9.46,9.13 | v9.46,9.13
  Bottom 0.152: v25.87,6.08 25.17,5.38 24.11,5.38 23.84,5.1 8.34,5.1 7.58,5.87 7.58,7.25 v9.46,9.13 | v22.46,9.14 22.71,9.14 23.05,9.48 24.6,9.48 30.39,15.27 32.65,15.27 33.44,16.06 33.44,22.13 26.83,28.74 22.25,28.74 21.01,29.97 J2.7
SWCLK/INT1  (via drill 0.25)
  Top 0.152: U2.19 13.4,16.77 17.23,12.94 R2.2 19.84,12.71 21.13,11.41 24.85,11.41 25.11,11.16 25.11,9.1 v24.09,8.09 U3.6
  Bottom 0.152: TP4.P$1 18,7.86 23.86,7.86 v24.09,8.09
SWDIO/BUTTON  (via drill 0.25)
  Top 0.152: U2.20 17.98,17.27 SW2.2 19.01,16.24 27.87,16.24 28.54,15.57 28.54,12.56 v28.92,12.18
  Bottom 0.152: TP1.P$1 10.68,8.16 16.27,8.16 16.39,8.04 17.07,8.04 17.18,8.16 22.59,8.16 23.3,8.87 27.72,8.87 28.96,10.11 28.92,10.14 v28.92,12.18
USB_N
  Top 0.152: U2.21 13.12,17.77 13.79,18.43 32.8,18.43 J1.2
USB_P
  Top 0.152: U2.22 13.11,18.27 13.59,18.75 31.77,18.75 32.05,19.03 J1.3
VBAT  (via drill 0.25)
  Top 0.254: v26.38,27.16 v26.38,30.72 26.36,30.72 25.35,31.73 R12.1 | v28.92,22.84 Q1.3
  Bottom 0.254: v26.38,30.72 24.14,32.95 9.56,32.95 2.5,25.89 3V.1 3.52,24.88 6.69,21.7 B1.+$2 | v26.38,27.16 28.92,24.62 v28.92,22.84 28.92,22.59 31.33,20.18 B1.+$1
VBUS
  Top 0.254: J1.1 33.27,17.73 34.25,16.75 34.25,14.52 D2.A
VHI  (via drill 0.25)
  Top 0.254: D1.C 27.61,29.74 27.61,26.3 R1.1 27.21,25.26 27.86,24.61 29.05,24.61 30.07,23.59 30.07,23.1 30.44,22.72 30.44,21.32 | D2.C 29.61,14.68 U1.1 29.61,15.29 29.3,15.6 29.3,16.87 29.61,17.19 U1.3 29.65,17.75 v29.65,17.95 | v29.65,19.24 30.44,20.02 30.44,21.32 | 30.44,21.32 29.87,21.89 Q1.1 28.54,21.89 C1.1
  Bottom 0.254: v29.65,17.95 v29.65,19.24
XIN32
  Top 0.152: U2.7 7.28,19.27 6.31,20.23 X1.P$1 3.38,20.23 C4.1
XOUT32
  Top 0.152: U2.8 7.25,18.77 6.31,17.83 X1.P$2 5.69,17.95 C5.1

### Text on the board
tPlace: 9-pin: | A0: PA02/I2 / SCL: PA23 (SER- / SDA: PA22 COM2) / A1: PA04/I4/TC1[0]/SCK / A2: PA05/I5/TC1[1]/MOSI / D0/A3: PA06/I6/TC2[0] / D1/A4: PA07/I7/TC2[1]/MISO | R12/13 are an optional voltage / divider for monitoring 3V / battery level. Causes 9-pin / D1/A4 to sit at ~1.4V when / coin cell is in use. Omit or cut -> / that trace right there. | 9-pin SPI: / SERCOM0 | Sensor Candle Concept | U4: 1.8v regulator / for analog sensor / boards. Enable by / pulling PA27 high. / (AREF=PA03) | Q1 & R1 let 3V battery take / over when USB is unplugged. | X1/C4/C5: / 32768Hz oscillator for RTC | User Button | PA31/I2 / (External / Interrupt 2) | USB: PA24/PA25 | U1: 3.3v regulator for / the main board, powered / by USB or 4.5V battery pin. | R3/R4: I²C pullups | by joey castillo / @josecastillo | LEDs are on TCC0: | (TCC0[0]) | LED0 PA14 WO0 / LED1 PA15 WO1 / LED2 PA10 WO2 / LED3 PA11 WO3 / LED6 PA16 WO6 / LED7 PA17 WO7 | LIS2DH on I²C / PA23/PA22 / INT1: PA30/I3
bPlace: CC-BY-SA 4.0 | Power to sensor board. / VCC is 2.4~3.3v depending / on how main board is powered. / AREF is 1.8v and can be disabled / (useful for low power situations). | Choose ONLY ONE / battery power option: / • 3x alkaline batteries on / the 4.5V pin (VCC=3.3v). / • 2x alkaline batteries on the 3V pin. / • 1x CR2032 coin cell in holder. / (VCC=VBAT) | VCC | AREF | GND | SWDIO | GND | 3V3 | SWCLK | !RESET | Cut this trace to cut power to / the LIS2DH accelerometer | Oddly Specific Objects / Sensor Candle Concept / OSO-SCAN-A1-00